# Altium schematic sheet xiqiu.SchDoc
size A4
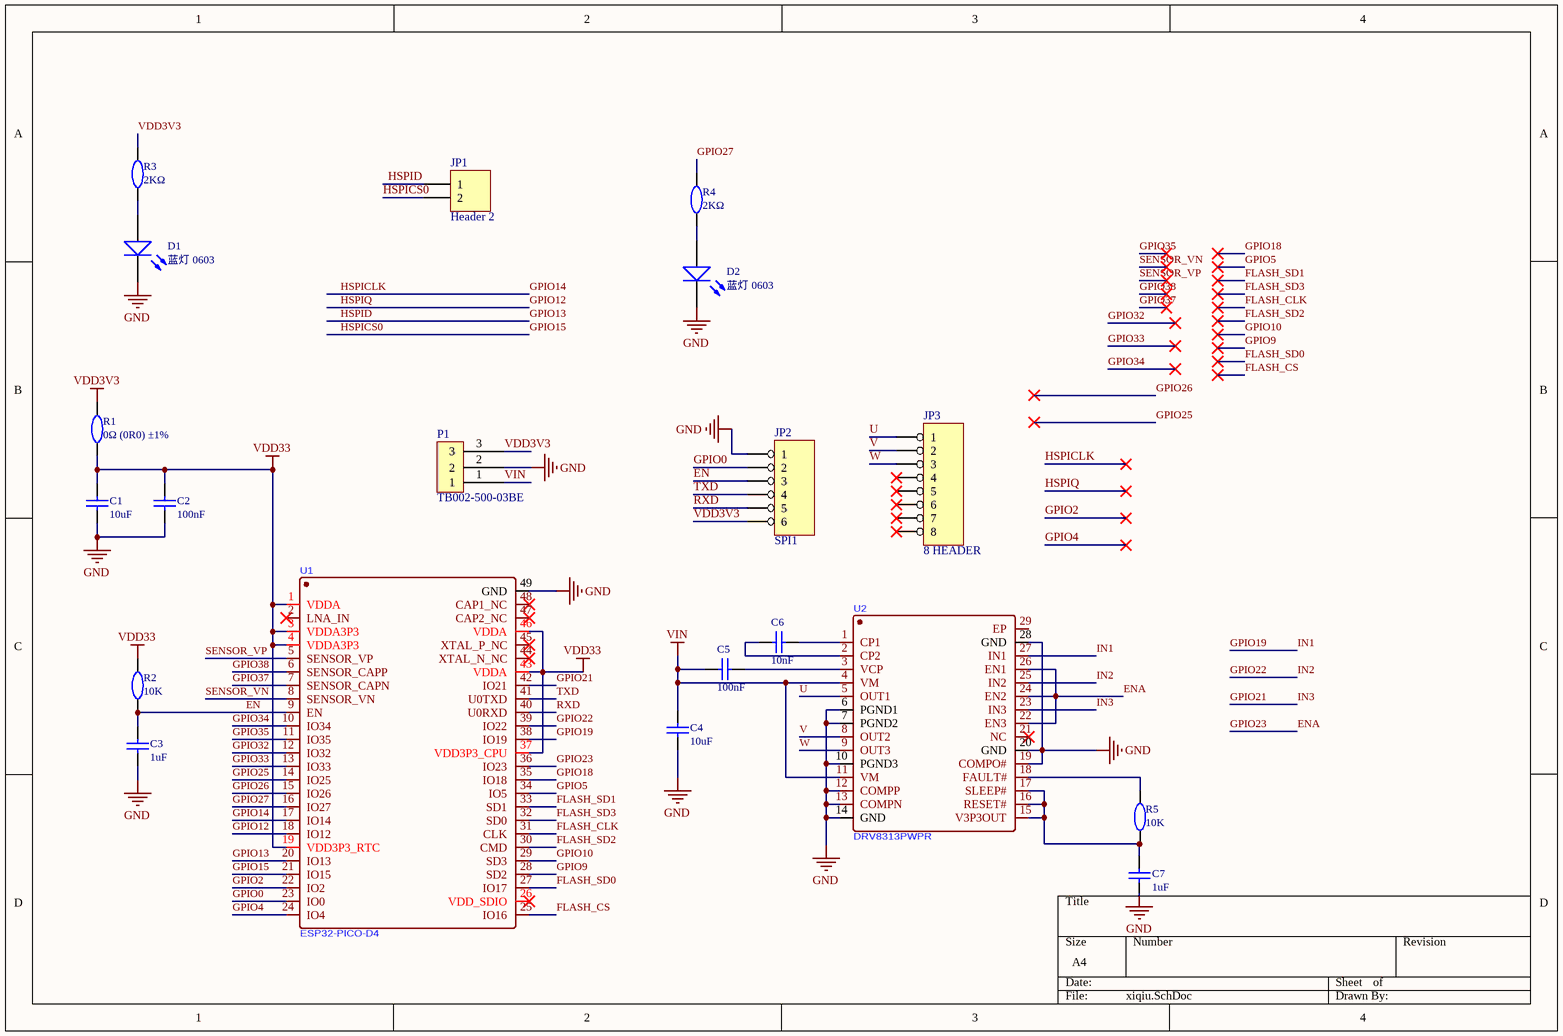
[diagram p0: xiqiu.SchDoc]

## Parts
C1  10uF  [0603C]
C2  100nF  [0603C]
C3  1uF  [0603C]
C4  10uF  [0603C]
C5  100nF  [0603C]
C6  10nF  [0603C]
C7  1uF  [0603C]
D1  蓝灯 0603  [0603_diode]
D2  蓝灯 0603  [0603_diode]
JP1  Header 2  [SHDR2]
JP2  SPI1  [SHDR6]
JP3  8 HEADER  [8P - WF25122]
P1  TB002-500-03BE  [SHDR3]
R1  0Ω (0R0) ±1%  [0603]
R2  10K  [0603R]
R3  2KΩ  [0603]
R4  2KΩ  [0603]
R5  10K  [0603R]
U1  ESP32-PICO-D4  [pico]
U2  DRV8313PWPR  [HTSSOP-28_L9.8-W4.5-P0.65-LS6.6-BL-EP]

## Nets
GND: C1.1 C2.1 C3.1 C4.1 C7.1 D1.K D2.K JP2.1 P1.2 U1.49(GND) U2.6(PGND1) U2.7(PGND2) U2.10(PGND3) U2.12(COMPP) U2.13(COMPN) U2.14(GND) U2.19(COMPO#) U2.20(GND) U2.28(GND)
VDD3V3: JP2.6 P1.3 R1.2 R3.2
VDD33: C1.2 C2.2 R1.1 R2.2 U1.1(VDDA) U1.3(VDDA3P3) U1.4(VDDA3P3) U1.19(VDD3P3_RTC) U1.37(VDD3P3_CPU) U1.43(VDDA) U1.46(VDDA)
VIN: C4.2 C5.2 P1.1 U2.4(VM) U2.11(VM)
EN: C3.2 JP2.3 R2.1 U1.9(EN)
ENA: U1.36(IO23) U2.22(EN3) U2.24(EN2) U2.26(EN1)  [also labelled GPIO23]
FLASH_CLK: U1.31(CLK)
FLASH_CS: U1.25(IO16)
FLASH_SD0: U1.27(IO17)
FLASH_SD1: U1.33(SD1)
FLASH_SD2: U1.30(CMD)
FLASH_SD3: U1.32(SD0)
GPIO0: JP2.2 U1.23(IO0)
GPIO2: U1.22(IO2)
GPIO4: U1.24(IO4)
GPIO5: U1.34(IO5)
GPIO9: U1.28(SD2)
GPIO10: U1.29(SD3)
GPIO12: U1.18(IO12)  [also labelled HSPIQ]
GPIO13: JP1.2(1) U1.20(IO13)  [also labelled HSPID]
GPIO14: U1.17(IO14)  [also labelled HSPICLK]
GPIO15: JP1.1(2) U1.21(IO15)  [also labelled HSPICS0]
GPIO18: U1.35(IO18)
GPIO19: U1.38(IO19) U2.27(IN1)  [also labelled IN1]
GPIO21: U1.42(IO21) U2.23(IN3)  [also labelled IN3]
GPIO22: U1.39(IO22) U2.25(IN2)  [also labelled IN2]
GPIO25: U1.14(IO25)
GPIO26: U1.15(IO26)
GPIO27: R4.2 U1.16(IO27)
GPIO32: U1.12(IO32)
GPIO33: U1.13(IO33)
GPIO34: U1.10(IO34)
GPIO35: U1.11(IO35)
GPIO37: U1.7(SENSOR_CAPN)
GPIO38: U1.6(SENSOR_CAPP)
RXD: JP2.5 U1.40(U0RXD)
SENSOR_VN: U1.8(SENSOR_VN)
SENSOR_VP: U1.5(SENSOR_VP)
TXD: JP2.4 U1.41(U0TXD)
U: JP3.1 U2.5(OUT1)
V: JP3.2 U2.8(OUT2)
W: JP3.3 U2.9(OUT3)
NetC5_1: C5.1 U2.3(VCP)
NetC6_1: C6.1 U2.2(CP2)
NetC6_2: C6.2 U2.1(CP1)
NetC7_2: C7.2 R5.1 U2.15(V3P3OUT) U2.16(RESET#) U2.17(SLEEP#)
NetD1_A: D1.A R3.1
NetD2_A: D2.A R4.1
NetR5_2: R5.2 U2.18(FAULT#)

Not connected (* = marked no-connect by the designer): JP3 4* 5* 6* 7* 8*; U1 2(LNA_IN)* 26(VDD_SDIO)* 44(XTAL_N_NC)* 45(XTAL_P_NC)* 47(CAP2_NC)* 48(CAP1_NC)*; U2 21(NC)* 29(EP)

## Library data of the parts
JP1 = Header 2: Header, 2-Pin; LatestRevisionDate: 17-Jul-2002; LatestRevisionNote: Re-released for DXP Platform.; Publisher: Altium Limited
JP2 = HEADER 6
JP3 = 8 HEADER: 8 Pin Header
C1 C4 = 10uF: ComponentLink1Description: 供应商链接; ComponentLink1URL: http://www.szlcsc.com/product/details_20411.html; Supplier: LC; SuppliersPartNumber: C19702
C2 C5 = 100nF: ComponentLink1Description: 供应商链接; ComponentLink1URL: http://www.szlcsc.com/product/details_15331.html; Supplier: LC; SuppliersPartNumber: C14663
C3 C7 = 1uF: ComponentLink1Description: 供应商链接; ComponentLink1URL: http://www.szlcsc.com/product/details_16531.html; Supplier: LC; SuppliersPartNumber: C15849
C6 = 10nF: ComponentLink1Description: 供应商链接; ComponentLink1URL: http://www.szlcsc.com/product/details_58143.html; Supplier: LC; SuppliersPartNumber: C57112
D1 D2 = 蓝灯 0603: ComponentLink1Description: 供应商链接; ComponentLink1URL: http://www.szlcsc.com/product/details_73150.html; Supplier: LC; SuppliersPartNumber: C72041
P1 = TB002-500-03BE: Supplier 1: Mouser; Supplier Part Number 1: 490-TB002-500-03BE
R1 = 0Ω (0R0) ±1%: ComponentLink1Description: 供应商链接; ComponentLink1URL: http://www.szlcsc.com/product/details_21903.html; Supplier: LC; SuppliersPartNumber: C21189
R2 R5 = 10K: ComponentLink1Description: 供应商链接; ComponentLink1URL: http://www.szlcsc.com/product/details_26547.html; Supplier: LC; SuppliersPartNumber: C25804
R3 R4 = 2KΩ: ComponentLink1Description: 供应商链接; ComponentLink1URL: http://www.szlcsc.com/product/details_23702.html; Supplier: LC; SuppliersPartNumber: C22975